# Altium schematic sheet RELAY.SchDoc
size 199 x 199 mm
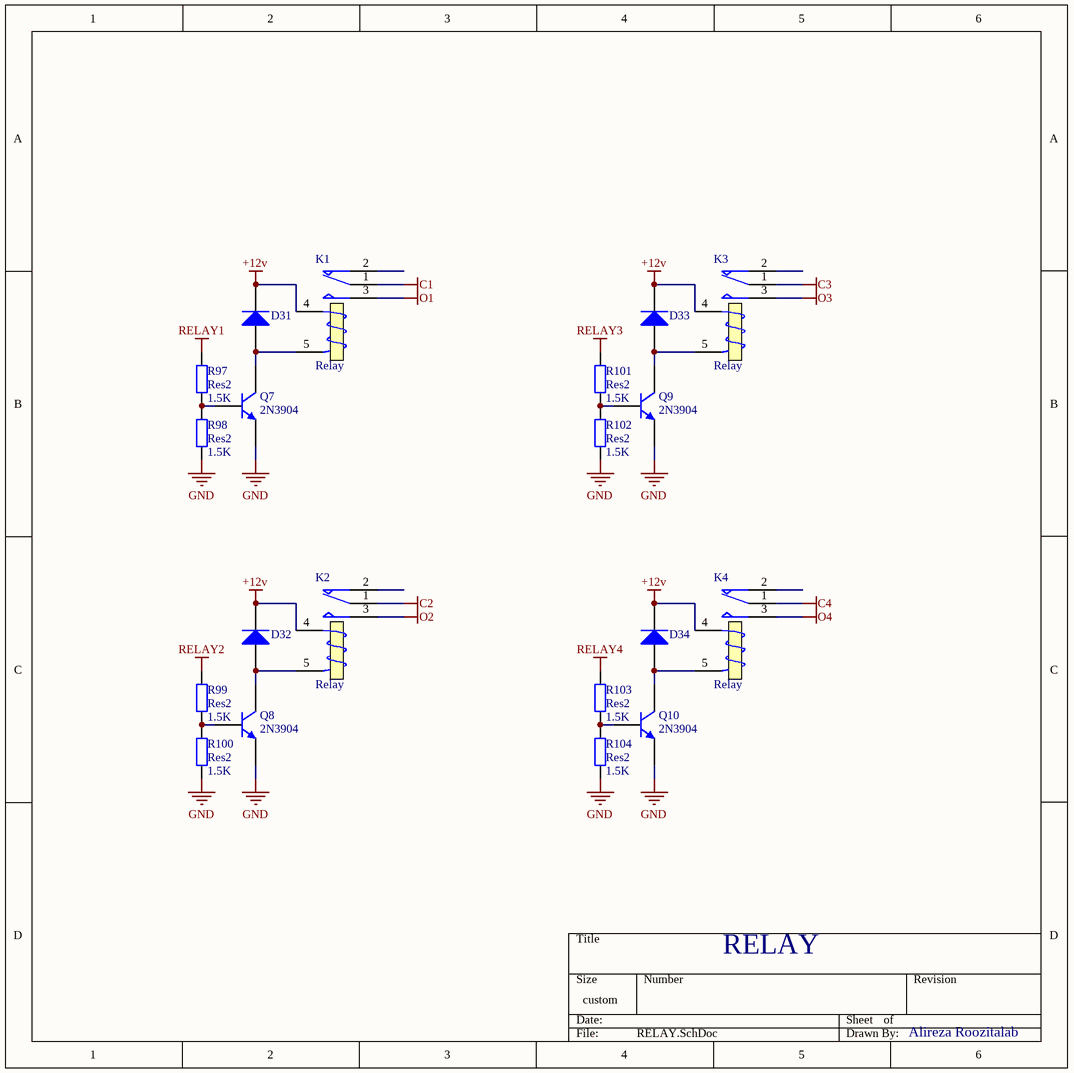
[diagram p0: RELAY.SchDoc]

## Parts
D31  Diode 1N4148  [Diode-1n4148 - SMD PAD]  (value not drawn)
D32  Diode 1N4148  [Diode-1n4148 - SMD PAD]  (value not drawn)
D33  Diode 1N4148  [Diode-1n4148 - SMD PAD]  (value not drawn)
D34  Diode 1N4148  [Diode-1n4148 - SMD PAD]  (value not drawn)
K1  Relay  [RELAY 12V ATX203]
K2  Relay  [RELAY 12V ATX203]
K3  Relay  [RELAY 12V ATX203]
K4  Relay  [RELAY 12V ATX203]
Q7  2N3904  [2N3906_SMD]
Q8  2N3904  [2N3906_SMD]
Q9  2N3904  [2N3906_SMD]
Q10  2N3904  [2N3906_SMD]
R97  Res2  value 1.5K  [RES 1206 (3216X08L)]
R98  Res2  value 1.5K  [RES 1206 (3216X08L)]
R99  Res2  value 1.5K  [RES 1206 (3216X08L)]
R100  Res2  value 1.5K  [RES 1206 (3216X08L)]
R101  Res2  value 1.5K  [RES 1206 (3216X08L)]
R102  Res2  value 1.5K  [RES 1206 (3216X08L)]
R103  Res2  value 1.5K  [RES 1206 (3216X08L)]
R104  Res2  value 1.5K  [RES 1206 (3216X08L)]

## Nets
+12v: D31.2(K) D32.2(K) D33.2(K) D34.2(K) K1.4 K2.4 K3.4 K4.4
C1: K1.1
C2: K2.1
C3: K3.1
C4: K4.1
GND: Q7.1(E) Q8.1(E) Q9.1(E) Q10.1(E) R98.1 R100.1 R102.1 R104.1
O1: K1.3
O2: K2.3
O3: K3.3
O4: K4.3
RELAY1: R97.2
RELAY2: R99.2
RELAY3: R101.2
RELAY4: R103.2
NetD31_1: D31.1(A) K1.5 Q7.3(C)
NetD32_1: D32.1(A) K2.5 Q8.3(C)
NetD33_1: D33.1(A) K3.5 Q9.3(C)
NetD34_1: D34.1(A) K4.5 Q10.3(C)
NetQ7_2: Q7.2(B) R97.1 R98.2
NetQ8_2: Q8.2(B) R99.1 R100.2
NetQ9_2: Q9.2(B) R101.1 R102.2
NetQ10_2: Q10.2(B) R103.1 R104.2

Not connected (* = marked no-connect by the designer): K1 2; K2 2; K3 2; K4 2

## Notes on the sheet
- RELAY
- Alireza Roozitalab

## Library data of the parts
D31-D34 = Diode 1N4148: High Conductance Fast Diode; Published: 8-Jun-2000; LatestRevisionDate: 17-Jul-2002; LatestRevisionNote: Re-released for DXP Platform.; DatasheetDocument: 1997; PackageReference: DO-35; Publisher: Altium Limited; Code_JEDEC: DO-204-AH; ComponentLink1Description: Manufacturer Link; ComponentLink1URL: http://www.fairchildsemi.com/; ComponentLink2Description: Datasheet; ComponentLink2URL: http://www.fairchildsemi.com/ds/1N%2F1N4148.pdf
K1-K4 = Relay: SPDT Relay; Published: 8-Jun-2000; LatestRevisionDate: 17-Jul-2002; LatestRevisionNote: Re-released for DXP Platform.; PackageReference: MODULE5B; Publisher: Altium Limited
Q7-Q10 = 2N3904: NPN General Purpose Amplifier; pin to pad: 1>2 2>1; Published: 8-Jun-2000; LatestRevisionDate: 15-Jan-2003; LatestRevisionNote: PCB Footprint 'BCY-W3/D4.7' replaced; DatasheetDocument: 1997; PackageDocument: Sep-1998; PackageReference: TO-92A; Publisher: Altium Limited; Code_JEDEC: TO-92A; ComponentLink1Description: Manufacturer Link; ComponentLink1URL: http://www.fairchildsemi.com/; ComponentLink2Description: Datasheet; ComponentLink2URL: http://www.fairchildsemi.com/ds/2N%2F2N3904.pdf
R97-R104 = Res2: Resistor; Published: 8-Jun-2000; LatestRevisionDate: 17-Jul-2002; LatestRevisionNote: Re-released for DXP Platform.; PackageReference: AXIAL-0.4; Publisher: Altium Limited